# EAGLE schematic vhdci-vhdci (EAGLE 6.3)
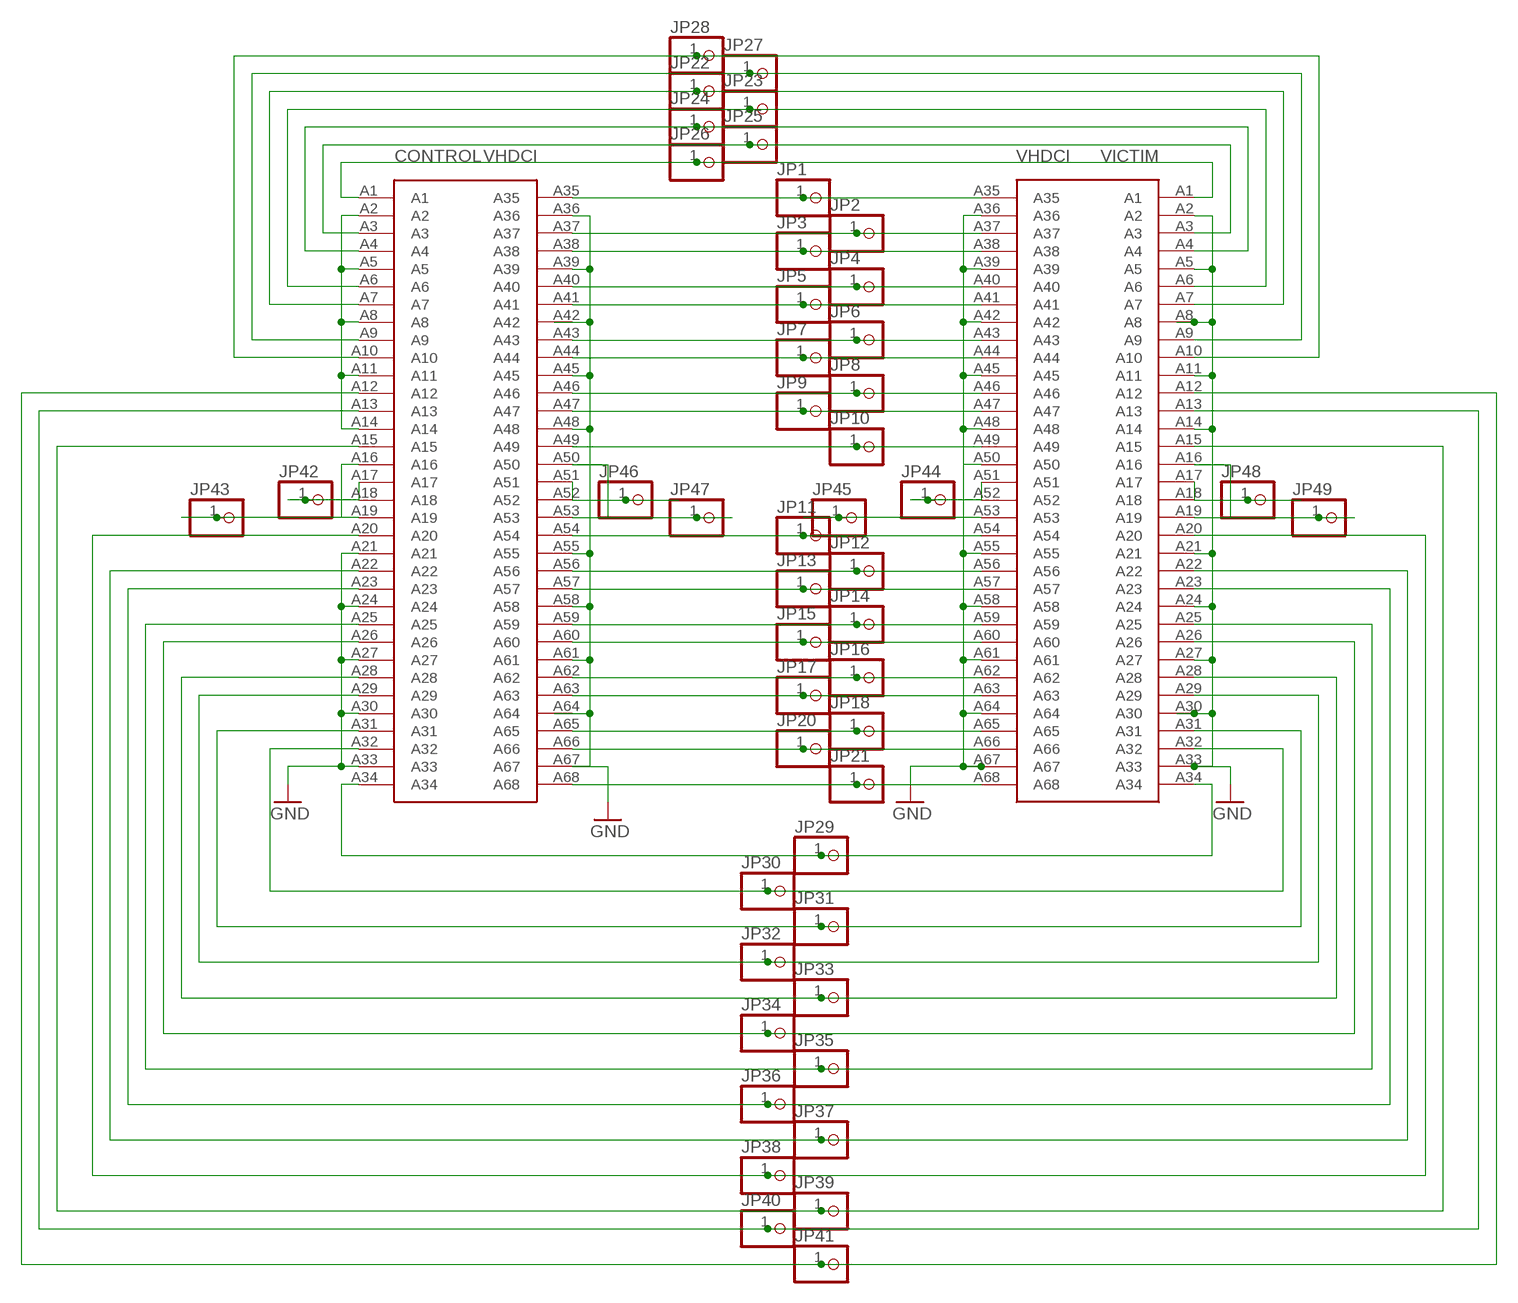
[diagram p0: schematic, sheet 1]

## Parts
CONTROL  CON-VHDCI-68  [CON-VHDCI]
JP1  PINHD-1X1  [1X01]
JP2  PINHD-1X1  [1X01]
JP3  PINHD-1X1  [1X01]
JP4  PINHD-1X1  [1X01]
JP5  PINHD-1X1  [1X01]
JP6  PINHD-1X1  [1X01]
JP7  PINHD-1X1  [1X01]
JP8  PINHD-1X1  [1X01]
JP9  PINHD-1X1  [1X01]
JP10  PINHD-1X1  [1X01]
JP11  PINHD-1X1  [1X01]
JP12  PINHD-1X1  [1X01]
JP13  PINHD-1X1  [1X01]
JP14  PINHD-1X1  [1X01]
JP15  PINHD-1X1  [1X01]
JP16  PINHD-1X1  [1X01]
JP17  PINHD-1X1  [1X01]
JP18  PINHD-1X1  [1X01]
JP20  PINHD-1X1  [1X01]
JP21  PINHD-1X1  [1X01]
JP22  PINHD-1X1  [1X01]
JP23  PINHD-1X1  [1X01]
JP24  PINHD-1X1  [1X01]
JP25  PINHD-1X1  [1X01]
JP26  PINHD-1X1  [1X01]
JP27  PINHD-1X1  [1X01]
JP28  PINHD-1X1  [1X01]
JP29  PINHD-1X1  [1X01]
JP30  PINHD-1X1  [1X01]
JP31  PINHD-1X1  [1X01]
JP32  PINHD-1X1  [1X01]
JP33  PINHD-1X1  [1X01]
JP34  PINHD-1X1  [1X01]
JP35  PINHD-1X1  [1X01]
JP36  PINHD-1X1  [1X01]
JP37  PINHD-1X1  [1X01]
JP38  PINHD-1X1  [1X01]
JP39  PINHD-1X1  [1X01]
JP40  PINHD-1X1  [1X01]
JP41  PINHD-1X1  [1X01]
JP42  PINHD-1X1  [1X01]
JP43  PINHD-1X1  [1X01]
JP44  PINHD-1X1  [1X01]
JP45  PINHD-1X1  [1X01]
JP46  PINHD-1X1  [1X01]
JP47  PINHD-1X1  [1X01]
JP48  PINHD-1X1  [1X01]
JP49  PINHD-1X1  [1X01]
VICTIM  CON-VHDCI-68  [CON-VHDCI]

## Nets
GND: CONTROL.A21 CONTROL.A24 CONTROL.A27 CONTROL.A30 CONTROL.A33 CONTROL.A36 CONTROL.A39 CONTROL.A45 CONTROL.A48 CONTROL.A55 CONTROL.A58 CONTROL.A61 CONTROL.A67 VICTIM.A2 VICTIM.A5 VICTIM.A8 VICTIM.A11 VICTIM.A14 VICTIM.A21 VICTIM.A24 VICTIM.A27 VICTIM.A30 VICTIM.A33 VICTIM.A36 VICTIM.A39 VICTIM.A42 VICTIM.A45 VICTIM.A48 VICTIM.A55 VICTIM.A58 VICTIM.A61 VICTIM.A64 VICTIM.A67
N$1: CONTROL.A35 JP1.1 VICTIM.A35
N$2: CONTROL.A37 JP2.1 VICTIM.A37
N$3: CONTROL.A38 JP3.1 VICTIM.A38
N$4: CONTROL.A40 JP4.1 VICTIM.A40
N$5: CONTROL.A41 JP5.1 VICTIM.A41
N$6: CONTROL.A43 JP6.1 VICTIM.A43
N$7: CONTROL.A44 JP7.1 VICTIM.A44
N$8: CONTROL.A46 JP8.1 VICTIM.A46
N$9: CONTROL.A47 JP9.1 VICTIM.A47
N$10: CONTROL.A49 JP10.1 VICTIM.A49
N$11: CONTROL.A54 JP11.1 VICTIM.A54
N$12: CONTROL.A56 JP12.1 VICTIM.A56
N$13: CONTROL.A57 JP13.1 VICTIM.A57
N$14: CONTROL.A59 JP14.1 VICTIM.A59
N$15: CONTROL.A60 JP15.1 VICTIM.A60
N$16: CONTROL.A62 JP16.1 VICTIM.A62
N$17: CONTROL.A63 JP17.1 VICTIM.A63
N$18: CONTROL.A65 JP18.1 VICTIM.A65
N$19: CONTROL.A66 JP20.1 VICTIM.A66
N$20: CONTROL.A68 JP21.1 VICTIM.A68
N$21: CONTROL.A1 JP26.1 VICTIM.A1
N$22: CONTROL.A3 JP25.1 VICTIM.A3
N$23: CONTROL.A4 JP24.1 VICTIM.A4
N$24: CONTROL.A6 JP23.1 VICTIM.A6
N$25: CONTROL.A7 JP22.1 VICTIM.A7
N$26: CONTROL.A9 JP27.1 VICTIM.A9
N$27: CONTROL.A10 JP28.1 VICTIM.A10
N$28: CONTROL.A34 JP29.1 VICTIM.A34
N$29: CONTROL.A32 JP30.1 VICTIM.A32
N$30: CONTROL.A31 JP31.1 VICTIM.A31
N$31: CONTROL.A29 JP32.1 VICTIM.A29
N$32: CONTROL.A28 JP33.1 VICTIM.A28
N$33: CONTROL.A26 JP34.1 VICTIM.A26
N$34: CONTROL.A25 JP35.1 VICTIM.A25
N$35: CONTROL.A23 JP36.1 VICTIM.A23
N$36: CONTROL.A22 JP37.1 VICTIM.A22
N$37: CONTROL.A20 JP38.1 VICTIM.A20
N$38: CONTROL.A15 JP39.1 VICTIM.A15
N$39: CONTROL.A13 JP40.1 VICTIM.A13
N$40: CONTROL.A12 JP41.1 VICTIM.A12
N$41: CONTROL.A2 CONTROL.A5 CONTROL.A8 CONTROL.A11 CONTROL.A14
N$42: CONTROL.A16 CONTROL.A19 JP43.1
N$43: CONTROL.A17 CONTROL.A18 JP42.1
N$44: CONTROL.A51 CONTROL.A52 JP46.1
N$45: JP44.1
N$46: JP45.1
N$47: CONTROL.A50 CONTROL.A53 JP47.1
N$48: JP48.1
N$49: JP49.1
Unconnected: CONTROL.A42 CONTROL.A64 VICTIM.A16 VICTIM.A17 VICTIM.A18 VICTIM.A19 VICTIM.A50 VICTIM.A51 VICTIM.A52 VICTIM.A53

## Library data of the parts
CONTROL VICTIM = con-vhdci-68:CON-VHDCI-68
JP1-JP18 JP20-JP49 = adafruit:PINHD-1X1: Pin header 1x1 for 0.1" spacing With round pins